# EAGLE schematic ModuleCarrier-NINA-B1-v1.0.0 (EAGLE 7.7.0)

## Sheet 1 of 2
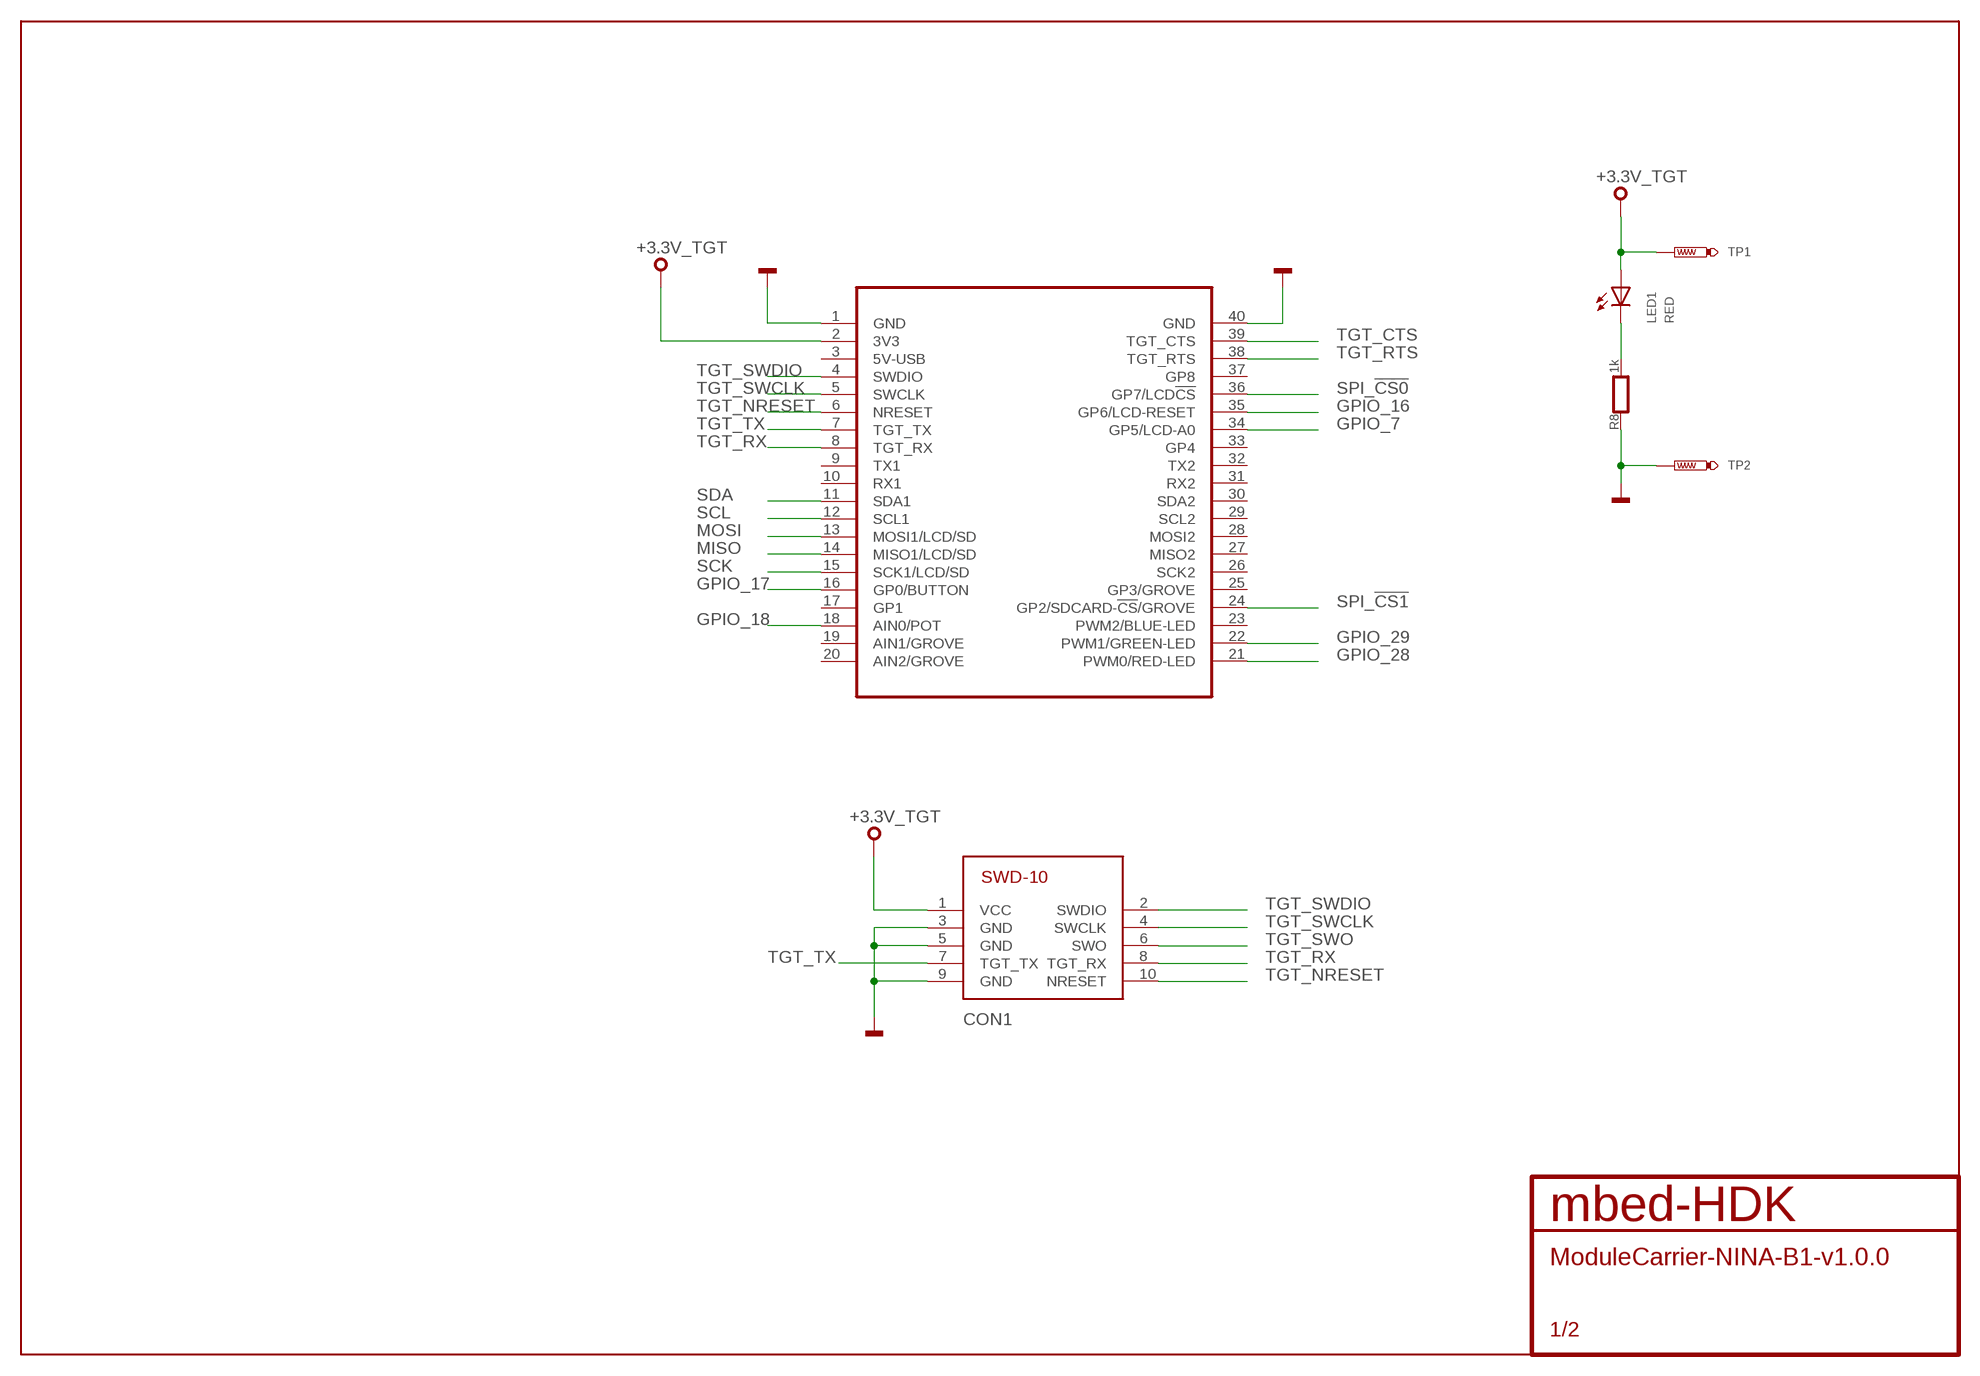
[diagram p0: schematic, sheet 1]

### Parts
CON1  SWD-10/TC2050_SMD  [FTSH-105-02]
LED1  RED  SMD_LED0603  [CHIPLED_0603]
MOD1  MODULE_DAUGHTER  [MODULE_DAUGHTER]
R8  1k  RESISTOR0603  [0603]
TP1  TEST-POINT-50R-PTH  [TP50-PTH]
TP2  TEST-POINT-50R-PTH  [TP50-PTH]

### Nets
+3.3V_TGT: CON1.1(VCC) LED1.A MOD1.2(3V3) TP1.TP ; also sheet 2
GND: CON1.3(GND) CON1.5(GND) CON1.9(GND) MOD1.1(GND) MOD1.40(GND) R8.1 TP2.TP ; also sheet 2
GPIO_7: MOD1.34(GP5/LCD-A0) ; also sheet 2
GPIO_16: MOD1.35(GP6/LCD-RESET) ; also sheet 2
GPIO_17: MOD1.16(GP0/BUTTON) ; also sheet 2
GPIO_18: MOD1.18(AIN0/POT) ; also sheet 2
GPIO_28: MOD1.21(PWM0/RED-LED) ; also sheet 2
GPIO_29: MOD1.22(PWM1/GREEN-LED) ; also sheet 2
MISO: MOD1.14(MISO1/LCD/SD) ; also sheet 2
MOSI: MOD1.13(MOSI1/LCD/SD) ; also sheet 2
PA_1: LED1.C R8.2
SCK: MOD1.15(SCK1/LCD/SD) ; also sheet 2
SCL: MOD1.12(SCL1) ; also sheet 2
SDA: MOD1.11(SDA1) ; also sheet 2
SPI_!CS0: MOD1.36(GP7/LCD!CS) ; also sheet 2
SPI_!CS1: MOD1.24(GP2/SDCARD-!CS!/GROVE) ; also sheet 2
TGT_CTS: MOD1.39(TGT_CTS) ; also sheet 2
TGT_NRESET: CON1.10(NRESET) MOD1.6(NRESET) ; also sheet 2
TGT_RTS: MOD1.38(TGT_RTS) ; also sheet 2
TGT_RX: CON1.8(TGT_RX) MOD1.8(TGT_RX) ; also sheet 2
TGT_SWCLK: CON1.4(SWCLK) MOD1.5(SWCLK) ; also sheet 2
TGT_SWDIO: CON1.2(SWDIO) MOD1.4(SWDIO) ; also sheet 2
TGT_SWO: CON1.6(SWO) ; also sheet 2
TGT_TX: CON1.7(TGT_TX) MOD1.7(TGT_TX) ; also sheet 2
Unconnected: MOD1.3(5V-USB) MOD1.9(TX1) MOD1.10(RX1) MOD1.17(GP1) MOD1.19(AIN1/GROVE) MOD1.20(AIN2/GROVE) MOD1.23(PWM2/BLUE-LED) MOD1.25(GP3/GROVE) MOD1.26(SCK2) MOD1.27(MISO2) MOD1.28(MOSI2) MOD1.29(SCL2) MOD1.30(SDA2) MOD1.31(RX2) MOD1.32(TX2) MOD1.33(GP4) MOD1.37(GP8)

## Sheet 2 of 2
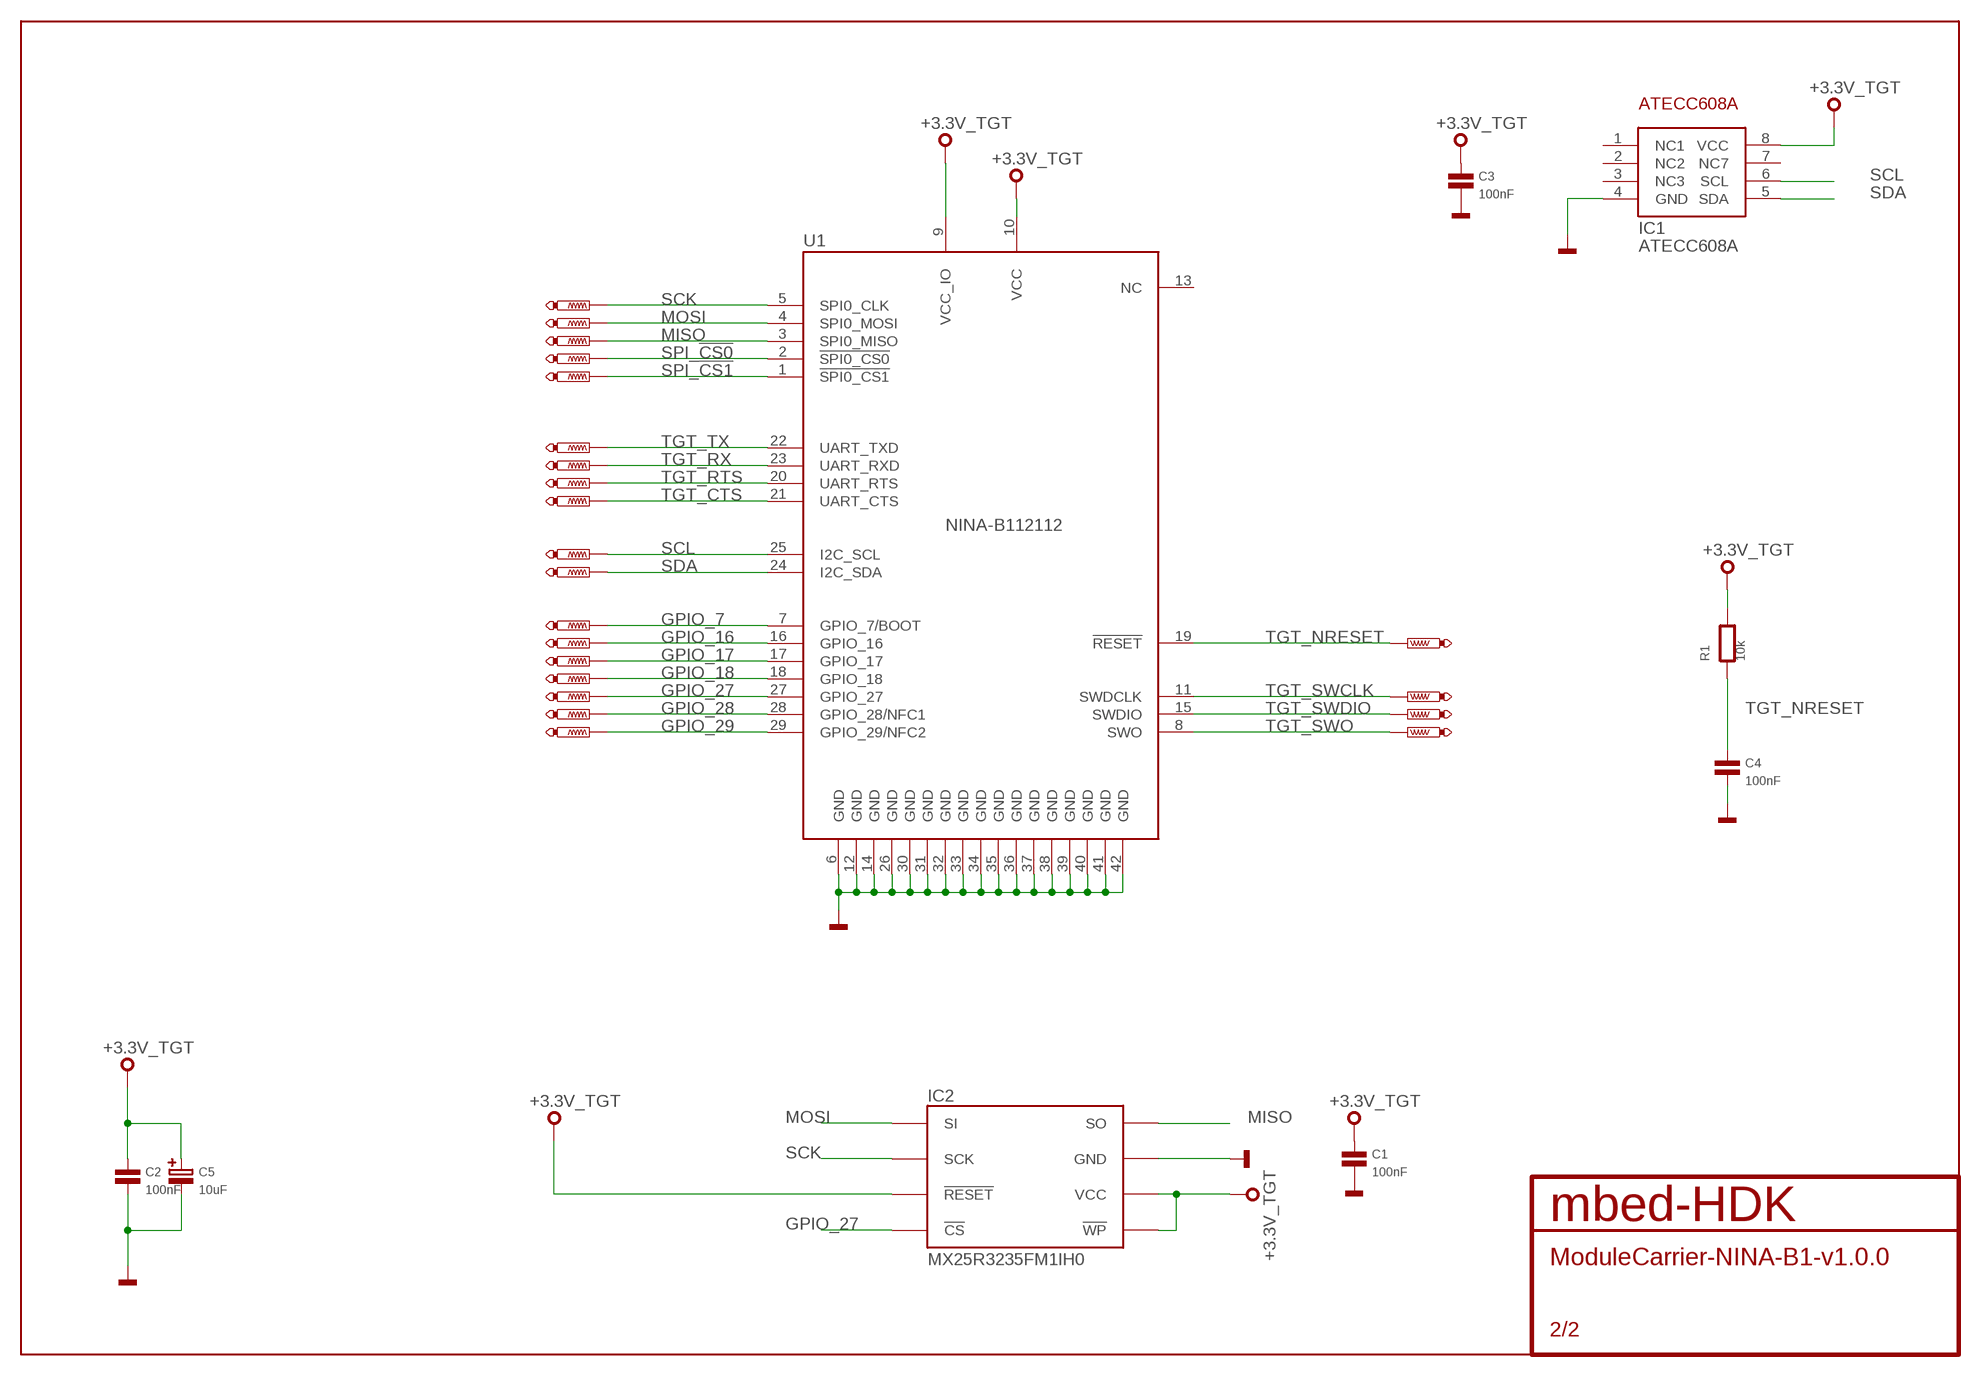
[diagram p1: schematic, sheet 2]

### Parts
C1  100nF  CAPACITOR0603  [0603]
C2  100nF  CAPACITOR0603  [0603]
C3  100nF  CAPACITOR0603  [0603]
C4  100nF  CAPACITOR0603  [0603]
C5  10uF  CAPACITOR-POLARISEDB  [SMC_B]
IC1  ATECC608A  [SO8]
IC2  MX25R3235FM1IH0  [SO8]
R1  10k  RESISTOR0603  [0603]
TP3  PTR1B1,27  [B1,27]
TP4  PTR1B1,27  [B1,27]
TP5  PTR1B1,27  [B1,27]
TP6  PTR1B1,27  [B1,27]
TP7  PTR1B1,27  [B1,27]
TP8  PTR1B1,27  [B1,27]
TP9  PTR1B1,27  [B1,27]
TP10  PTR1B1,27  [B1,27]
TP11  PTR1B1,27  [B1,27]
TP12  PTR1B1,27  [B1,27]
TP13  PTR1B1,27  [B1,27]
TP14  PTR1B1,27  [B1,27]
TP15  PTR1B1,27  [B1,27]
TP16  PTR1B1,27  [B1,27]
TP17  PTR1B1,27  [B1,27]
TP18  PTR1B1,27  [B1,27]
TP19  PTR1B1,27  [B1,27]
TP20  PTR1B1,27  [B1,27]
TP21  PTR1B1,27  [B1,27]
TP22  PTR1B1,27  [B1,27]
TP23  PTR1B1,27  [B1,27]
TP24  PTR1B1,27  [B1,27]
U1  NINA-B112112  [NINA112-42]

### Nets
+3.3V_TGT: C1.1 C2.1 C3.1 C5.+ IC1.8(VCC) IC2.3(!WP) IC2.7(!RESET) IC2.8(VCC) R1.2 U1.9(VCC_IO) U1.10(VCC) ; also sheet 1
GND: C1.2 C2.2 C3.2 C4.2 C5.- IC1.4(GND) IC2.4(GND) U1.6(GND) U1.12(GND) U1.14(GND) U1.26(GND) U1.30(GND) U1.31(GND) U1.32(GND) U1.33(GND) U1.34(GND) U1.35(GND) U1.36(GND) U1.37(GND) U1.38(GND) U1.39(GND) U1.40(GND) U1.41(GND) U1.42(GND) ; also sheet 1
GPIO_7: TP14.TP U1.7(GPIO_7/BOOT) ; also sheet 1
GPIO_16: TP15.TP U1.16(GPIO_16) ; also sheet 1
GPIO_17: TP16.TP U1.17(GPIO_17) ; also sheet 1
GPIO_18: TP17.TP U1.18(GPIO_18) ; also sheet 1
GPIO_27: IC2.1(!CS) TP18.TP U1.27(GPIO_27)
GPIO_28: TP19.TP U1.28(GPIO_28/NFC1) ; also sheet 1
GPIO_29: TP20.TP U1.29(GPIO_29/NFC2) ; also sheet 1
MISO: IC2.2(SO) TP5.TP U1.3(SPI0_MISO) ; also sheet 1
MOSI: IC2.5(SI) TP4.TP U1.4(SPI0_MOSI) ; also sheet 1
SCK: IC2.6(SCK) TP3.TP U1.5(SPI0_CLK) ; also sheet 1
SCL: IC1.6(SCL) TP12.TP U1.25(I2C_SCL) ; also sheet 1
SDA: IC1.5(SDA) TP13.TP U1.24(I2C_SDA) ; also sheet 1
SPI_!CS0: TP6.TP U1.2(!SPI0_CS0) ; also sheet 1
SPI_!CS1: TP7.TP U1.1(!SPI0_CS1!) ; also sheet 1
TGT_CTS: TP11.TP U1.21(UART_CTS) ; also sheet 1
TGT_NRESET: C4.1 R1.1 TP21.TP U1.19(!RESET) ; also sheet 1
TGT_RTS: TP10.TP U1.20(UART_RTS) ; also sheet 1
TGT_RX: TP9.TP U1.23(UART_RXD) ; also sheet 1
TGT_SWCLK: TP22.TP U1.11(SWDCLK) ; also sheet 1
TGT_SWDIO: TP23.TP U1.15(SWDIO) ; also sheet 1
TGT_SWO: TP24.TP U1.8(SWO) ; also sheet 1
TGT_TX: TP8.TP U1.22(UART_TXD) ; also sheet 1
Unconnected: IC1.1(NC1) IC1.2(NC2) IC1.3(NC3) IC1.7(NC7) U1.13(NC)

## Library data of the parts
C1-C4 = mbed-HDK-RLC:CAPACITOR: Capacitor
C5 = mbed-HDK-RLC:CAPACITOR-POLARISED: Polarised capacitor; MF: Kemet; MFN: T491B106K020AT; OC-DIGIKEY: 399-8298-1-ND; OC-MOUSER: 80-T491B106K020; OC-NEWARK: 57K1740
CON1 = mbed-HDK-Connector:SWD-10/TC2050: 1mm pitch 10-Pin Cortex Programming Header with optional TC2050 footprint solderless interchangeable
IC1 = blackbriar:ATECC608A
IC2 = blackbriar:MX25R3235FM1IH0: Serial Flash 32 Mb 80 Mhz; MF: Macronix; MFN: MX25R3235FM2IH0; OC-DIGIKEY: 1092-1174-ND
LED1 = mbed-HDK-Optical:SMD_LED: LED SMD, Colour Red; MF: Wurth Electronics Inc; MFN: 150060RS75000; OC-DIGIKEY: 732-4978-1-ND; OC-MOUSER: 710-150060RS75000; OC-NEWARK: 2322071
MOD1 = blackbriar:MODULE_DAUGHTER
R1 R8 = mbed-HDK-RLC:RESISTOR: Resistor
TP1 TP2 = mbed-HDK:TEST-POINT
TP3-TP24 = blackbriar:PTR1: TEST PIN
U1 = blackbriar:NINA-B112: NINA-B111: BLE stand-alone module u-blox.com